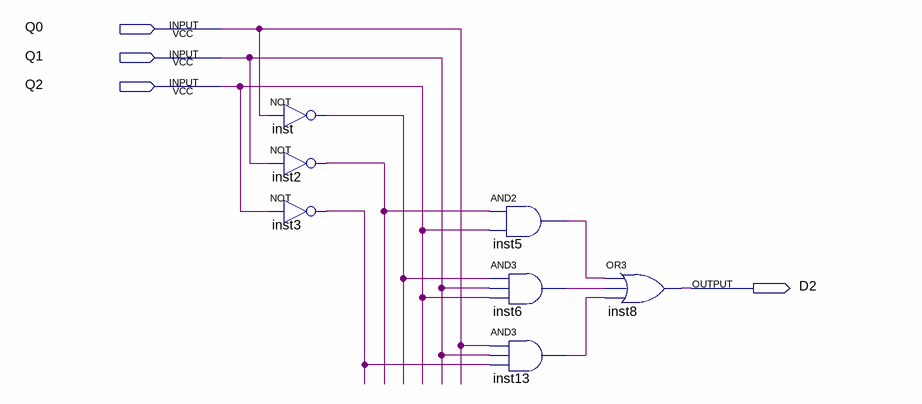
[diagram p0: schematic sheet]
// Quartus schematic D2.bdf as structural Verilog: 7 symbols, 4 pins
module D2 (
  input  Q0,
  input  Q1,
  input  Q2,
  output D2
);

  wire inst2_out, inst3_out, inst5_out, inst6_out, inst13_out, inst_out;

  not inst (inst_out, Q0);
  not inst2 (inst2_out, Q1);
  not inst3 (inst3_out, Q2);
  and inst5 (inst5_out, inst2_out, Q2);
  and inst6 (inst6_out, inst_out, Q1, Q2);
  and inst13 (inst13_out, Q0, Q1, inst3_out);
  or inst8 (D2, inst5_out, inst6_out, inst13_out);
endmodule
